# EAGLE design balloon-v03 (EAGLE 7.6.0)
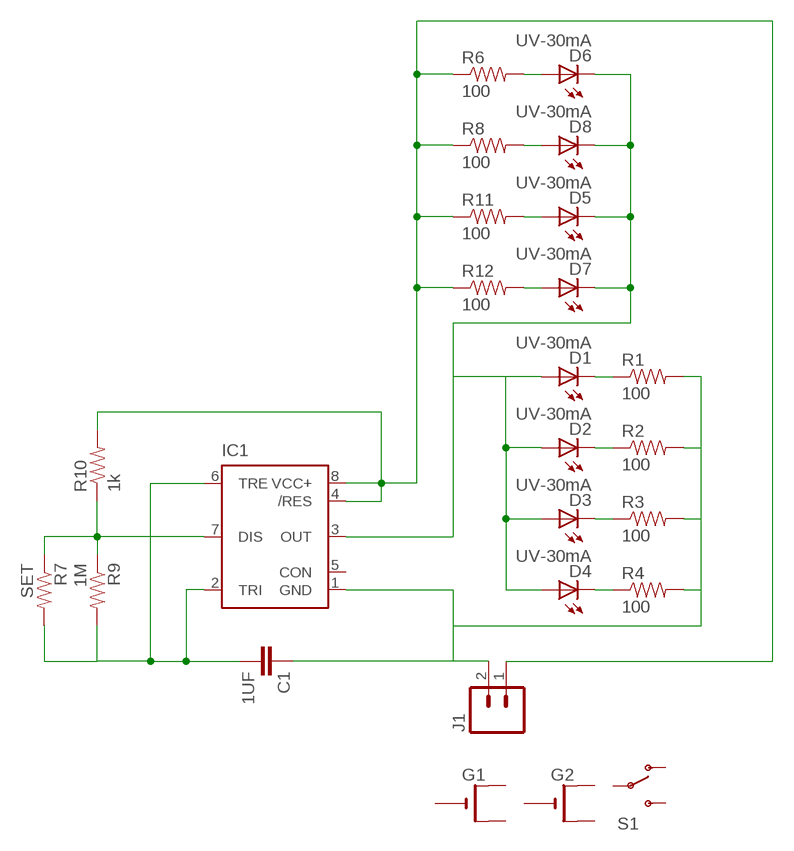
[diagram p0: schematic, sheet 1]

## Parts
C1  1UF  CAP0603-CAP  [0603-CAP]
D1  UV-30mA  LEDCHIPLED_0603  [CHIPLED_0603]
D2  UV-30mA  LEDCHIPLED_0603  [CHIPLED_0603]
D3  UV-30mA  LEDCHIPLED_0603  [CHIPLED_0603]
D4  UV-30mA  LEDCHIPLED_0603  [CHIPLED_0603]
D5  UV-30mA  LEDCHIPLED_0603  [CHIPLED_0603]
D6  UV-30mA  LEDCHIPLED_0603  [CHIPLED_0603]
D7  UV-30mA  LEDCHIPLED_0603  [CHIPLED_0603]
D8  UV-30mA  LEDCHIPLED_0603  [CHIPLED_0603]
G1  CR2032SMT  [CR2032-SMD]
G2  CR2032SMT  [CR2032-SMD]
IC1  NE555D  [SO08]
J1  M02PTH3  [1X02_LONGPADS]
R1  100  RESISTOR0603-RES  [0603-RES]
R2  100  RESISTOR0603-RES  [0603-RES]
R3  100  RESISTOR0603-RES  [0603-RES]
R4  100  RESISTOR0603-RES  [0603-RES]
R6  100  RESISTOR0603-RES  [0603-RES]
R7  SET  RESISTOR0603  [0603-RES]
R8  100  RESISTOR0603-RES  [0603-RES]
R9  1M  RESISTOR0603-RES  [0603-RES]
R10  1k  RESISTOR0603-RES  [0603-RES]
R11  100  RESISTOR0603-RES  [0603-RES]
R12  100  RESISTOR0603-RES  [0603-RES]
S1  SWITCH-SPDT-SMD-A  [SWITCH-SPST-SMD-A]

## Nets
DISCHARGE: IC1.7(DIS) R7.1 R9.1 R10.1
GND: C1.1 IC1.1(GND) J1.2 R1.2 R2.2 R3.2 R4.2
N$1: D8.A R8.2
N$2: D5.A R11.2
N$3: D1.C R1.1
N$4: D7.A R12.2
N$5: D2.C R2.1
N$6: D6.A R6.2
N$7: D3.C R3.1
N$9: D4.C R4.1
OUT: D1.A D2.A D3.A D4.A D5.C D6.C D7.C D8.C IC1.3(OUT)
THRESHOLD: C1.2 IC1.2(TRI) IC1.6(TRE) R7.2 R9.2
VCC: IC1.4(/RES) IC1.8(VCC+) J1.1 R6.1 R8.1 R10.2 R11.1 R12.1
Unconnected: G1.+$1(+) G1.+$2(+1) G1.- G2.+$1(+) G2.+$2(+1) G2.- IC1.5(CON) S1.1(O) S1.2(P) S1.3(S)

## Library data of the parts
C1 = SparkFun-Capacitors:CAP: Capacitor Standard 0603 ceramic capacitor, and 0.1" leaded capacitor.; DIGIKEY_PART_ID: 1276-1946-1-ND
D1-D8 = led:LED: LED OSRAM: - CHIPLED LG R971, LG N971, LY N971, LG Q971, LY Q971, LO R971, LY R971 LH N974, LH R974 LS Q976, LO Q976, LY Q976 LO Q996 - Hyper CHIPLED LW Q18S LB Q993, LB Q99A, LB R99A - SideLED LS A670, LO A670, LY A670, LG A670, LP A670 LB A673, LV A673, LT A673, LW A673 LH A674 LY A675 LS A676, LA A676, LO A676, LY A676, LW A676 LS A679, LY A679, LG A679 - Hyper Micro SIDELED® LS Y876, LA Y876, LO Y876, LY Y876 LT Y87S - SmartLED LW L88C, LW L88S LB L89C, LB L89S, LG L890 LS L89K, LO L89K, LY L89K LS L896, LA L896, LO L896, LY L896 - TOPLED LS T670, LO T670, LY T670, LG T670, LP T670 LSG T670, LSP T670, LSY T670, LOP T670, LYG T670 LG T671, LOG T671, LSG T671 LB T673, LV T673, LT T673, LW T673 LH T674 LS T676, LA T676, LO T676, LY T676, LB T676, LH T676, LSB T676, LW T676 LB T67C, LV T67C, LT T67C, LS T67K, LO T67K, LY T67K, LW E67C LS E67B, LA E67B, LO E67B, LY E67B, LB E67C, LV E67C, LT E67C LW T67C LS T679, LY T679, LG T679 LS T770, LO T770, LY T770, LG T770, LP T770 LB T773, LV T773, LT T773, LW T773 LH T774 LS E675, LA E675, LY E675, LS T675 LS T776, LA T776, LO T776, LY T776, LB T776 LHGB T686 LT T68C, LB T68C - Hyper Mini TOPLED® LB M676 - Mini TOPLED Santana® LG M470 LS M47K, LO M47K, LY M47K Source: http://www.osram.convergy.de LUXEON: - LUMILED® LXK2-PW12-R00, LXK2-PW12-S00, LXK2-PW14-U00, LXK2-PW14-V00 LXK2-PM12-R00, LXK2-PM12-S00, LXK2-PM14-U00 LXK2-PE12-Q00, LXK2-PE12-R00, LXK2-PE12-S00, LXK2-PE14-T00, LXK2-PE14-U00 LXK2-PB12-K00, LXK2-PB12-L00, LXK2-PB12-M00, LXK2-PB14-N00, LXK2-PB14-P00, LXK2-PB14-Q00 LXK2-PR12-L00, LXK2-PR12-M00, LXK2-PR14-Q00, LXK2-PR14-R00 LXK2-PD12-Q00, LXK2-PD12-R00, LXK2-PD12-S00 LXK2-PH12-R00, LXK2-PH12-S00 LXK2-PL12-P00, LXK2-PL12-Q00, LXK2-PL12-R00 Source: www.luxeon.com KINGBRIGHT: KA-3528ASYC Source: www.kingbright.com
G1 G2 = adafruit:CR2032; DIGIKEY_PART_ID: BK-913-ND
IC1 = SparkFun-AnalogIC:NE555: General purpose bipolar Timer; DIGIKEY_PART_ID: ICM7555CBAZ-TCT-ND
J1 = SparkFun-Connectors:M02: Standard 2-pin 0.1" header. Use with - straight break away headers ( PRT-00116) - right angle break away headers (PRT-00553) - swiss pins (PRT-00743) - machine pins (PRT-00117) - female headers (PRT-00115) Molex polarized connector foot print use with: PRT-08233 with associated crimp pins and housings. 2.54_SCREWTERM for use with PRT-10571. 3.5mm Screw Terminal footprints for PRT-08084 5mm Screw Terminal footprints for use with PRT-08432
R1-R4 R6 R8 R11 R12 = SparkFun-Resistors:RESISTOR: Resistor Basic schematic elements and footprints for 0603, 1206, and PTH resistors.; DIGIKEY_PART_ID: P100BZCT-ND
R7 R9 = SparkFun-Resistors:RESISTOR: Resistor Basic schematic elements and footprints for 0603, 1206, and PTH resistors.; DIGIKEY_PART_ID: P1MBZCT-ND
R10 = SparkFun-Resistors:RESISTOR: Resistor Basic schematic elements and footprints for 0603, 1206, and PTH resistors.; DIGIKEY_PART_ID: P1KBZCT-ND
S1 = SparkFun-Electromechanical:SWITCH-SPDT: SPDT Switch Simple slide switch, Spark Fun Electronics SKU : COM-00102 DPDT SMT slide switch, AYZ0202, SWCH-08179; DIGIKEY_PART_ID: 679-1847-1-ND; PROD_ID: SWCH-10651

## Board
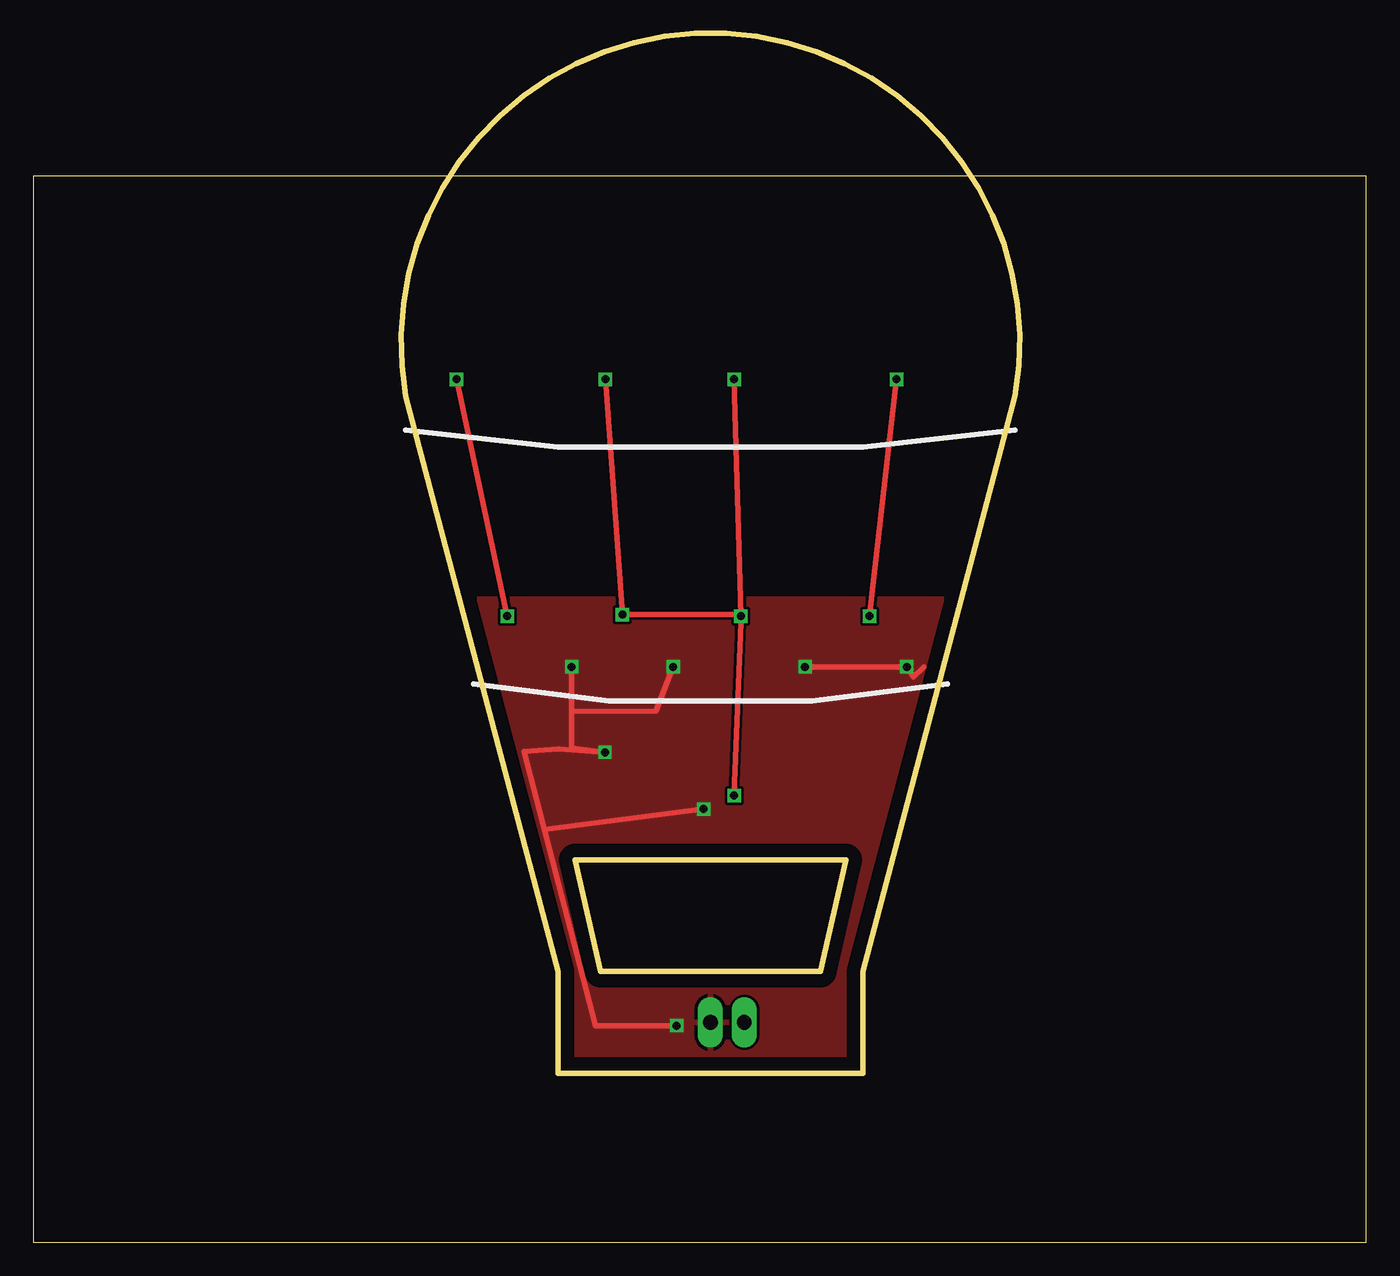
[diagram p1: board, top side]
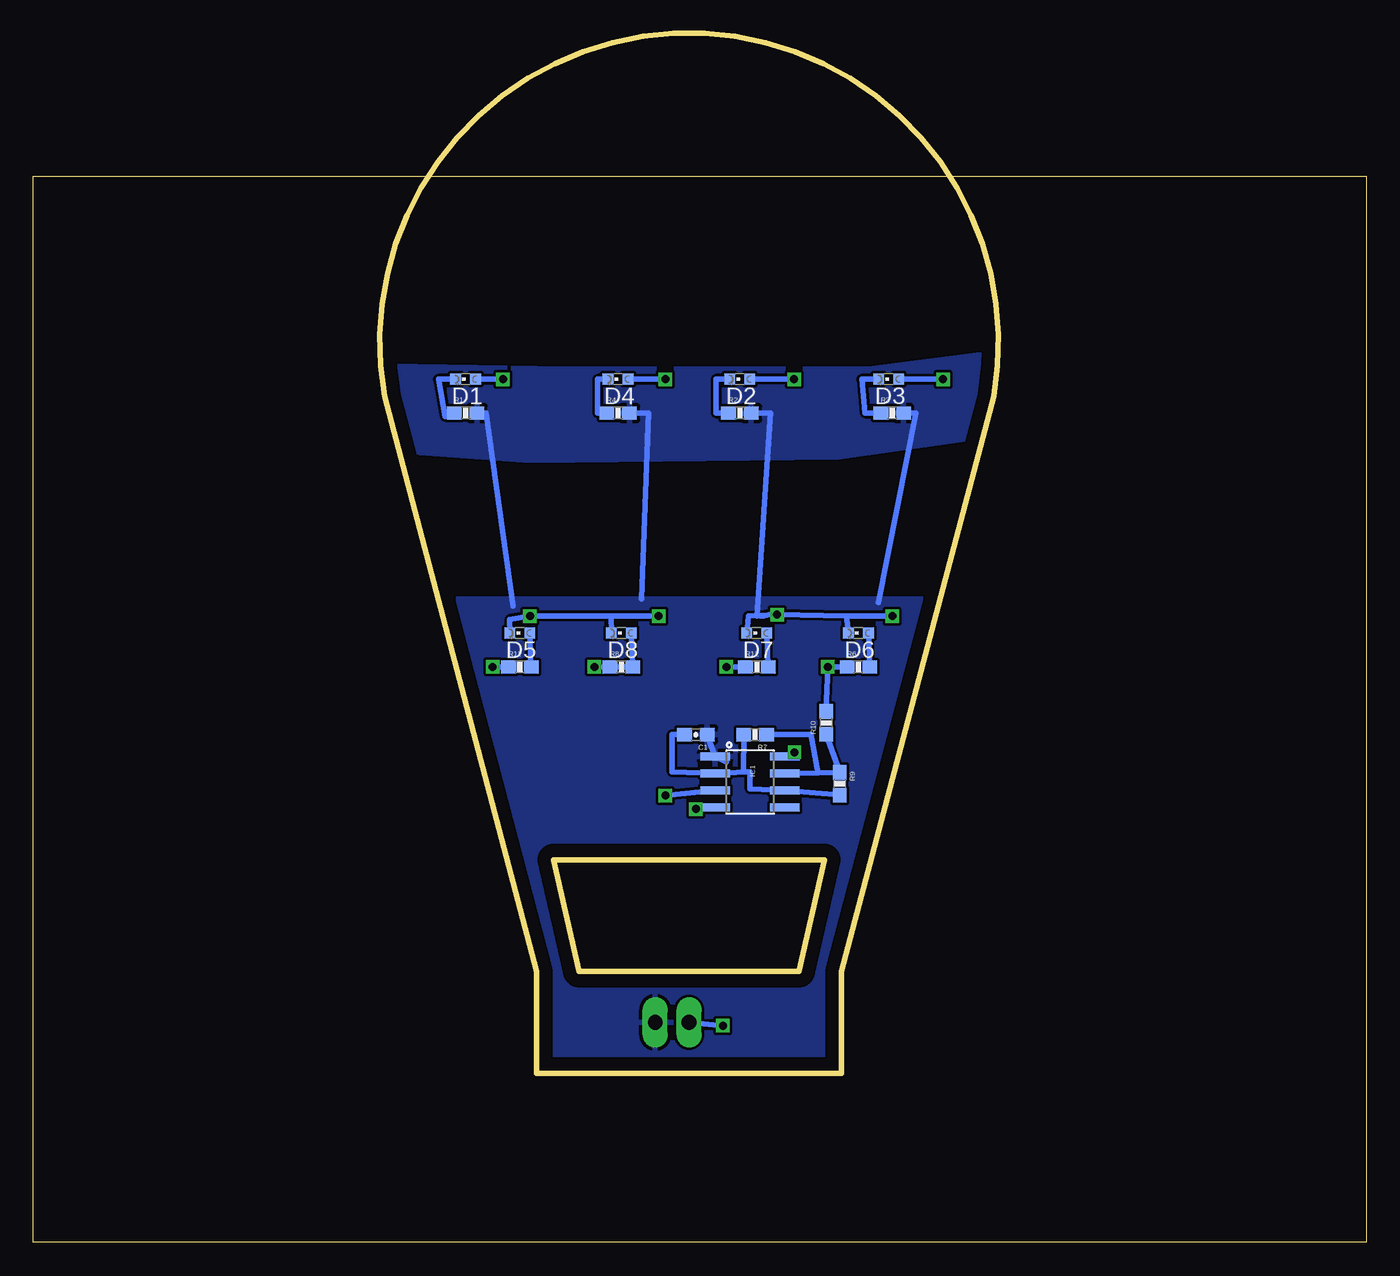
[diagram p2: board, bottom side, seen from below]

Size 100 x 90.72 mm. Coordinates in mm from the lower left corner, seen from the top.
Outline: 0,0 100,0 100,80 0,80 0,0
Outline: 27.94,63.5 arc-200 73.66,63.5 62.23,20.32 62.23,12.7 39.37,12.7 39.37,20.32 27.94,63.5
Outline: 40.64,28.7 42.55,20.32 59.05,20.32 60.96,28.7 40.64,28.7
Copper layers (1*16): Top 0.035mm / dielectric 1.5mm / Bottom 0.035mm
Design rules "default": minimum track width 10mil, minimum drill 24mil, track to track 8mil, track to pad 8mil, pad to pad 8mil, via to via 8mil, smd to smd 8mil, copper to edge 40mil, drill to drill 8mil, minimum pad ring 10mil, minimum via ring 8mil, stop-mask expansion 4mil, vias tented up to drill 0mil, thermal gap 10mil

### Footprints (pad centres in the part's own frame; a part is rotated, then mirrored left to right if it is on the bottom)
0603-CAP = smd 1.1 x 1: 1 -0.85,0; 2 0.85,0
CHIPLED_0603 = smd 0.8 x 0.8: A 0,-0.75; C 0,0.75
CR2032-SMD = smd 5.08 x 5.08: +$1 -12.7,0; +$2 12.7,0 | smd 4.064 x 4.064: - 0,0
SO08 = smd 0.61 x 2.21: 1 -1.905,-2.616; 2 -0.635,-2.616; 3 0.635,-2.616; 4 1.905,-2.616; 5 1.905,2.616; 6 0.635,2.616; 7 -0.635,2.616; 8 -1.905,2.616
1X02_LONGPADS = drill 1.118 pad 1.88 long: 1 0,0; 2 2.54,0
0603-RES = smd 1.1 x 1: 1 -0.85,0; 2 0.85,0
SWITCH-SPST-SMD-A = smd 0.7 x 1.5: 1 -2.25,-1.75; 2 -0.75,-1.75; 3 2.25,-1.75 | smd 1 x 0.6: GND1 -3.65,1; GND3 3.65,1 | smd 1 x 0.8: GND2 -3.65,-1.1; GND4 3.65,-1.1 | hole 0.9: -1.5,0; 1.5,0

### Placement (x,y rotation side)
C1  50.29,38.1 180 bottom
D1  67.56,64.77 90 bottom
D2  46.99,64.77 90 bottom
D3  35.81,64.77 90 bottom
D4  56.13,64.77 90 bottom
D5  63.5,45.72 90 bottom
D6  38.1,45.72 90 bottom
D7  45.72,45.72 90 bottom
D8  55.88,45.72 90 bottom
G1  -29.21,11.43 0 top  (outside the outline)
G2  -29.21,34.29 0 top  (outside the outline)
IC1  46.23,34.54 270 bottom
J1  50.8,16.51 0 top
R1  67.56,62.23 0 bottom
R2  46.99,62.23 0 bottom
R3  35.56,62.23 0 bottom
R4  56.13,62.23 0 bottom
R6  38.1,43.18 0 bottom
R7  45.85,38.1 180 bottom
R8  55.88,43.18 0 bottom
R9  39.5,34.42 270 bottom
R10  40.51,38.99 90 bottom
R11  63.5,43.18 0 bottom
R12  45.72,43.18 0 bottom
S1  -31.75,58.42 0 top  (outside the outline)

### Tracks (layer width: path | path; a pad name or v marks a point on that pad's centre or on a via)
DISCHARGE
  Bottom 0.406: R10.1 R9.1 41.14,35.23 | IC1.7 41.14,35.23 | R7.1 41.66,38.1 41.14,35.23
GND
  Bottom 0.406: 48.01,36.07 IC1.1 C1.1 | R3.2 33.78,62.23 36.58,48.01 | R2.2 44.7,62.23 45.72,46.99 | R4.2 53.85,62.23 54.36,48.26 | 66.04,62.23 64.01,47.75
  pour Bottom: 33.02,48.26 68.58,48.26 69.85,46.99 63.5,11.43 38.1,11.43 30.48,46.99
  pour Bottom: 27.43,66.8 37.34,65.53 59.94,65.53 75.69,65.79 73.66,59.44 62.74,58.67 39.62,58.93 26.92,60.71 27.43,67.06
N$1
  Bottom 0.406: 56.52,43.18 R8.2 D8.A
N$2
  Bottom 0.406: D5.A 62.74,45.21 | 62.74,45.21 62.74,44.7 | R11.2 62.74,45.21
N$3
  Bottom 0.406: D1.C 69.6,64.77 69.09,61.98 R1.1
N$4
  Bottom 0.406: R12.2 D7.A
N$5
  Bottom 0.406: D2.C 48.77,64.77 48.77,62.23 R2.1
N$6
  Bottom 0.406: R6.2 D6.A
N$7
  Bottom 0.406: D3.C 37.85,64.77 37.59,62.23 R3.1
N$9
  Bottom 0.406: D4.C 57.66,64.77 57.66,62.23 R4.1
OUT  (via drill 0.6)
  Top 0.406: v42.93,64.77 v44.2,47.11 52.72,47.11 v53.09,46.99 | v31.75,64.77 v35.56,46.99 | v64.77,64.77 v62.74,46.99 | v52.58,33.53 53.08,46.5 | 53.08,46.5 v53.09,46.99 | v53.09,46.99 53.08,46.73 53.08,46.5 | v52.58,64.77 v53.09,46.99
  Bottom 0.406: D6.C 38.99,46.99 | 45.45,46.98 45.21,46.99 44.2,47.24 v44.2,47.11 | 56.64,46.99 53.09,47.02 v53.09,46.99 | 56.64,46.99 D8.C | 56.64,46.99 v62.74,46.99 64.26,46.74 D5.C | 46.35,46.99 46.35,46.98 | 46.35,46.98 v44.2,47.11 | v42.93,64.77 D2.A | D3.A v31.75,64.77 | v35.56,46.99 38.99,46.99 | D4.A v52.58,64.77 | D1.A v64.77,64.77 | IC1.3 v52.58,33.53 | D7.C 46.35,46.98 | 38.99,46.99 v44.2,47.11
THRESHOLD
  Bottom 0.406: 46.46,35.3 46.23,35.31 46.23,34.04 IC1.6 R9.2 | 46.46,35.3 IC1.2 52.07,35.31 52.07,38.1 C1.2 | 46.46,35.3 46.74,35.31 R7.2
VCC  (via drill 0.6)
  Top 0.406: v48.26,16.26 42.16,16.26 38.48,30.51 | 38.48,30.51 38.35,30.99 v50.29,32.51 | 38.48,30.51 36.83,36.83 39.41,37.01 v42.89,36.77 40.39,37.08 v40.39,43.18 | v48.01,43.18 46.74,39.88 R10.2 | v57.91,43.18 v65.53,43.18 | v65.53,43.18 65.79,43.18 | v65.53,43.18 66.04,42.42 66.8,43.18
  Bottom 0.406: J1.1 v48.26,16.26 | v50.29,32.51 IC1.4 | R12.1 v48.01,43.18 | IC1.8 v42.89,36.77 | R6.1 v40.39,43.18 R10.2 | R8.1 v57.91,43.18 | R11.1 v65.53,43.18
  pour Top: 30.48,48.26 71.12,48.26 66.04,8.89 30.48,11.43
(copper drawn outside any net)
  shapes: Bottom circle x1